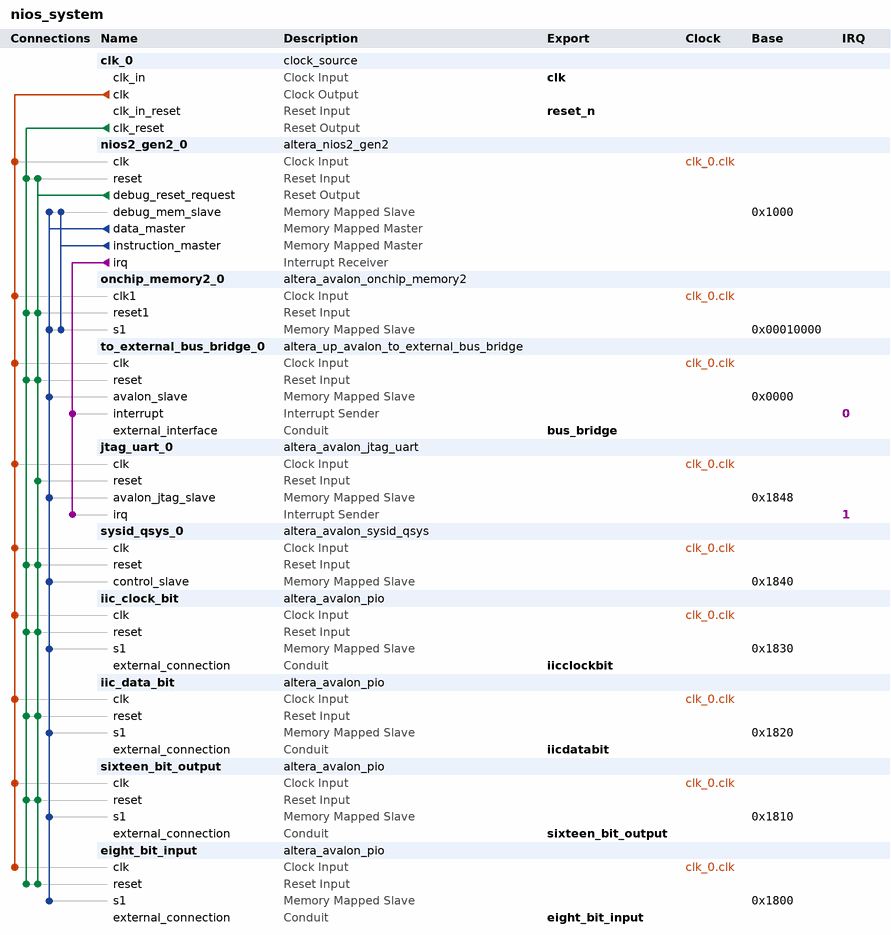
[diagram p0: system contents]
# Platform Designer (Qsys) system nios_system, Cyclone V 5CSEMA5F31C6
# Parameters at their usual value, and those the tool derives, are not listed.
package require -exact qsys 16.1
create_system nios_system
set_project_property DEVICE_FAMILY {Cyclone V}
set_project_property DEVICE 5CSEMA5F31C6

add_instance clk_0 clock_source 16.1
set_instance_parameter_value clk_0 clockFrequency 50000000

add_instance nios2_gen2_0 altera_nios2_gen2 16.1
set_instance_parameter_value nios2_gen2_0 dcache_size 2048
set_instance_parameter_value nios2_gen2_0 exceptionSlave onchip_memory2_0.s1
set_instance_parameter_value nios2_gen2_0 icache_size 4096
set_instance_parameter_value nios2_gen2_0 impl Tiny
set_instance_parameter_value nios2_gen2_0 resetSlave onchip_memory2_0.s1

add_instance onchip_memory2_0 altera_avalon_onchip_memory2 16.1
set_instance_parameter_value onchip_memory2_0 dataWidth 32
set_instance_parameter_value onchip_memory2_0 dualPort false
set_instance_parameter_value onchip_memory2_0 initMemContent true
set_instance_parameter_value onchip_memory2_0 initializationFileName onchip_mem.hex
set_instance_parameter_value onchip_memory2_0 memorySize 32768

add_instance to_external_bus_bridge_0 altera_up_avalon_to_external_bus_bridge 16.1
set_instance_parameter_value to_external_bus_bridge_0 addr_size 2
set_instance_parameter_value to_external_bus_bridge_0 addr_size_multiplier Kbytes
set_instance_parameter_value to_external_bus_bridge_0 data_size 32

add_instance jtag_uart_0 altera_avalon_jtag_uart 16.1
set_instance_parameter_value jtag_uart_0 simInteractiveOptions NO_INTERACTIVE_WINDOWS

add_instance sysid_qsys_0 altera_avalon_sysid_qsys 16.1
set_instance_parameter_value sysid_qsys_0 id -1157645569

add_instance iic_clock_bit altera_avalon_pio 16.1
set_instance_parameter_value iic_clock_bit direction Output
set_instance_parameter_value iic_clock_bit width 1

add_instance iic_data_bit altera_avalon_pio 16.1
set_instance_parameter_value iic_data_bit direction Bidir
set_instance_parameter_value iic_data_bit width 1

add_instance sixteen_bit_output altera_avalon_pio 16.1
set_instance_parameter_value sixteen_bit_output direction Output
set_instance_parameter_value sixteen_bit_output width 16

add_instance eight_bit_input altera_avalon_pio 16.1
set_instance_parameter_value eight_bit_input direction Input
set_instance_parameter_value eight_bit_input width 8

# connections
add_connection clk_0.clk eight_bit_input.clk clock
add_connection clk_0.clk iic_clock_bit.clk clock
add_connection clk_0.clk iic_data_bit.clk clock
add_connection clk_0.clk jtag_uart_0.clk clock
add_connection clk_0.clk nios2_gen2_0.clk clock
add_connection clk_0.clk onchip_memory2_0.clk1 clock
add_connection clk_0.clk sixteen_bit_output.clk clock
add_connection clk_0.clk sysid_qsys_0.clk clock
add_connection clk_0.clk to_external_bus_bridge_0.clk clock
add_connection clk_0.clk_reset eight_bit_input.reset reset
add_connection clk_0.clk_reset iic_clock_bit.reset reset
add_connection clk_0.clk_reset iic_data_bit.reset reset
add_connection clk_0.clk_reset nios2_gen2_0.reset reset
add_connection clk_0.clk_reset onchip_memory2_0.reset1 reset
add_connection clk_0.clk_reset sixteen_bit_output.reset reset
add_connection clk_0.clk_reset sysid_qsys_0.reset reset
add_connection clk_0.clk_reset to_external_bus_bridge_0.reset reset
add_connection nios2_gen2_0.debug_reset_request eight_bit_input.reset reset
add_connection nios2_gen2_0.debug_reset_request iic_clock_bit.reset reset
add_connection nios2_gen2_0.debug_reset_request iic_data_bit.reset reset
add_connection nios2_gen2_0.debug_reset_request jtag_uart_0.reset reset
add_connection nios2_gen2_0.debug_reset_request nios2_gen2_0.reset reset
add_connection nios2_gen2_0.debug_reset_request onchip_memory2_0.reset1 reset
add_connection nios2_gen2_0.debug_reset_request sixteen_bit_output.reset reset
add_connection nios2_gen2_0.debug_reset_request sysid_qsys_0.reset reset
add_connection nios2_gen2_0.debug_reset_request to_external_bus_bridge_0.reset reset
add_connection nios2_gen2_0.data_master eight_bit_input.s1 avalon
set_connection_parameter_value nios2_gen2_0.data_master/eight_bit_input.s1 baseAddress 0x1800
add_connection nios2_gen2_0.data_master iic_clock_bit.s1 avalon
set_connection_parameter_value nios2_gen2_0.data_master/iic_clock_bit.s1 baseAddress 0x1830
add_connection nios2_gen2_0.data_master iic_data_bit.s1 avalon
set_connection_parameter_value nios2_gen2_0.data_master/iic_data_bit.s1 baseAddress 0x1820
add_connection nios2_gen2_0.data_master jtag_uart_0.avalon_jtag_slave avalon
set_connection_parameter_value nios2_gen2_0.data_master/jtag_uart_0.avalon_jtag_slave baseAddress 0x1848
add_connection nios2_gen2_0.data_master nios2_gen2_0.debug_mem_slave avalon
set_connection_parameter_value nios2_gen2_0.data_master/nios2_gen2_0.debug_mem_slave baseAddress 0x1000
add_connection nios2_gen2_0.data_master onchip_memory2_0.s1 avalon
set_connection_parameter_value nios2_gen2_0.data_master/onchip_memory2_0.s1 baseAddress 0x00010000
add_connection nios2_gen2_0.data_master sixteen_bit_output.s1 avalon
set_connection_parameter_value nios2_gen2_0.data_master/sixteen_bit_output.s1 baseAddress 0x1810
add_connection nios2_gen2_0.data_master sysid_qsys_0.control_slave avalon
set_connection_parameter_value nios2_gen2_0.data_master/sysid_qsys_0.control_slave baseAddress 0x1840
add_connection nios2_gen2_0.data_master to_external_bus_bridge_0.avalon_slave avalon
set_connection_parameter_value nios2_gen2_0.data_master/to_external_bus_bridge_0.avalon_slave baseAddress 0x0000
add_connection nios2_gen2_0.instruction_master nios2_gen2_0.debug_mem_slave avalon
set_connection_parameter_value nios2_gen2_0.instruction_master/nios2_gen2_0.debug_mem_slave baseAddress 0x1000
add_connection nios2_gen2_0.instruction_master onchip_memory2_0.s1 avalon
set_connection_parameter_value nios2_gen2_0.instruction_master/onchip_memory2_0.s1 baseAddress 0x00010000
add_connection nios2_gen2_0.irq jtag_uart_0.irq interrupt
set_connection_parameter_value nios2_gen2_0.irq/jtag_uart_0.irq irqNumber 1
add_connection nios2_gen2_0.irq to_external_bus_bridge_0.interrupt interrupt
set_connection_parameter_value nios2_gen2_0.irq/to_external_bus_bridge_0.interrupt irqNumber 0

# exported interfaces
add_interface bus_bridge conduit end
set_interface_property bus_bridge EXPORT_OF to_external_bus_bridge_0.external_interface
add_interface clk clock sink
set_interface_property clk EXPORT_OF clk_0.clk_in
add_interface eight_bit_input conduit end
set_interface_property eight_bit_input EXPORT_OF eight_bit_input.external_connection
add_interface iicclockbit conduit end
set_interface_property iicclockbit EXPORT_OF iic_clock_bit.external_connection
add_interface iicdatabit conduit end
set_interface_property iicdatabit EXPORT_OF iic_data_bit.external_connection
add_interface reset_n reset sink
set_interface_property reset_n EXPORT_OF clk_0.clk_in_reset
add_interface sixteen_bit_output conduit end
set_interface_property sixteen_bit_output EXPORT_OF sixteen_bit_output.external_connection

set_interconnect_requirement {$system} qsys_mm.clockCrossingAdapter HANDSHAKE
set_interconnect_requirement {$system} qsys_mm.enableEccProtection FALSE
set_interconnect_requirement {$system} qsys_mm.insertDefaultSlave FALSE
set_interconnect_requirement {$system} qsys_mm.maxAdditionalLatency 1

save_system nios_system.qsys
